# Altium schematic sheet Telemetry_schematic.SchDoc: oiaejrboidr
size A4; Revision: 1.1; SheetNumber: 1; SheetTotal: 1
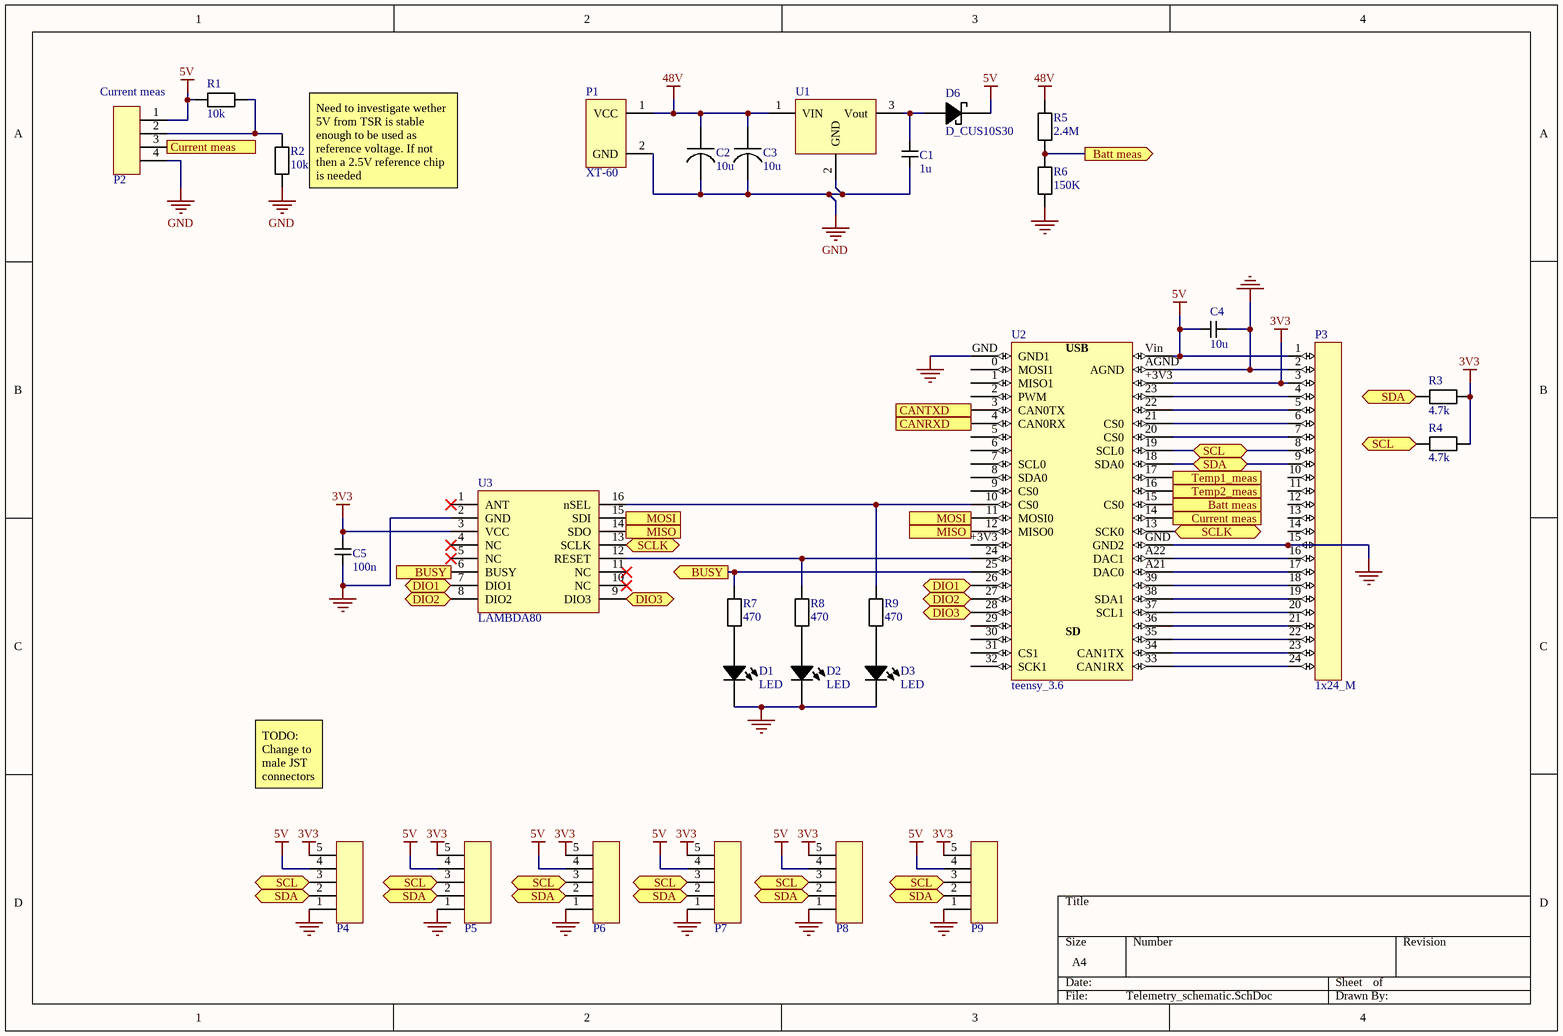
[diagram p0: Telemetry_schematic.SchDoc]

## Parts
C1  value 1u  [C_SMD_0805_pcb]  (hidden comment: SMD)
C2  value 10u  [C_EL_SMT_Ø6.3]  (hidden comment: C_EL_SMT_Ø6.3)
C3  value 10u  [C_EL_SMT_Ø6.3]  (hidden comment: C_EL_SMT_Ø6.3)
C4  value 10u  [C_SMD_0805_pcb]  (hidden comment: SMD)
C5  value 100n  [C_SMD_0805_pcb]  (hidden comment: SMD)
D1  LED  [D_LED_0805]
D2  LED  [D_LED_0805]
D3  LED  [D_LED_0805]
D6  D_CUS10S30  [D_SC-76]
P1  XT-60  [XT-60]
P2  JST_SE_4PIN  [JST_SE_4PIN]  (value not drawn)
P3  1x24_M  [PIN_HEADER_M_1x24]
P4  1x5_M  [PIN_HEADER_M_1x5]  (value not drawn)
P5  1x5_M  [PIN_HEADER_M_1x5]  (value not drawn)
P6  1x5_M  [PIN_HEADER_M_1x5]  (value not drawn)
P7  1x5_M  [PIN_HEADER_M_1x5]  (value not drawn)
P8  1x5_M  [PIN_HEADER_M_1x5]  (value not drawn)
P9  1x5_M  [PIN_HEADER_M_1x5]  (value not drawn)
R1  value 10k  [R_SMD_0805_pcb]  (hidden comment: SMD)
R2  value 10k  [R_SMD_0805_pcb]  (hidden comment: SMD)
R3  value 4.7k  [R_SMD_0805_pcb]  (hidden comment: SMD)
R4  value 4.7k  [R_SMD_0805_pcb]  (hidden comment: SMD)
R5  value 2.4M  [R_SMD_0805_pcb]  (hidden comment: SMD)
R6  value 150K  [R_SMD_0805_pcb]  (hidden comment: SMD)
R7  value 470  [R_SMD_0805_pcb]  (hidden comment: SMD)
R8  value 470  [R_SMD_0805_pcb]  (hidden comment: SMD)
R9  value 470  [R_SMD_0805_pcb]  (hidden comment: SMD)
U1  TSR_0.6-4850WI  [TSR_0.6-4850WI]  (value not drawn)
U2  teensy_3.6  [teensy_3.6]
U3  LAMBDA80  [LAMBDA62_SMT]

## Ports
Batt meas (in), Batt meas (out), BUSY (in), BUSY (out), CANRXD (out), CANTXD (in), Current meas (in), Current meas (out), DIO1 (bidir), DIO2 (bidir), DIO3 (bidir), MISO (in), MISO (out), MOSI (in), MOSI (out), SCL (bidir), SCLK (bidir), SDA (bidir), Temp1_meas (in), Temp2_meas (in)

## Nets
3V3: C5.1 P3.3 P4.5 P5.5 P6.5 P7.5 P8.5 P9.5 R3.1 R4.1 U2.+3V3 U3.3(VCC)
5V: C4.2 D6.2 P2.1 P3.1 P4.4 P5.4 P6.4 P7.4 P8.4 P9.4 R1.1 U2.Vin
48V: C2.2 C3.2 P1.1(VCC) R5.2 U1.1(VIN)
GND: C1.2 C2.1 C3.1 C4.1 C5.2 D1.2 D2.2 D3.2 P1.2(GND) P2.4 P3.2 P3.15 P4.1 P5.1 P6.1 P7.1 P8.1 P9.1 R2.1 R6.1 U1.2(GND) U2.AGND U2.GND(GND1) U3.2(GND)
Batt meas: R5.1 R6.2 U2.15(CS0) ; port Batt meas
BUSY: R7.2 U2.25 U3.6(BUSY) ; port BUSY
CANRXD: U2.4(CAN0RX) ; port CANRXD
CANTXD: U2.3(CAN0TX) ; port CANTXD
Current meas: P2.3 U2.14 ; port Current meas
DIO1: U2.26 U3.7(DIO1) ; port DIO1
DIO2: U2.27 U3.8(DIO2) ; port DIO2
DIO3: U2.28 U3.9(DIO3) ; port DIO3
MISO: U2.12(MISO0) U3.14(SDO) ; port MISO
MOSI: U2.11(MOSI0) U3.15(SDI) ; port MOSI
SCL: P3.8 P4.3 P5.3 P6.3 P7.3 P8.3 P9.3 R4.2 U2.19(SCL0) ; port SCL
SCLK: U2.13(SCK0) U3.13(SCLK) ; port SCLK
SDA: P3.9 P4.2 P5.2 P6.2 P7.2 P8.2 P9.2 R3.2 U2.18(SDA0) ; port SDA
Temp1_meas: U2.17 ; port Temp1_meas
Temp2_meas: U2.16 ; port Temp2_meas
NetC1_1: C1.1 D6.1 U1.3(Vout)
NetD1_1: D1.1 R7.1
NetD2_1: D2.1 R8.1
NetD3_1: D3.1 R9.1
NetP2_2: P2.2 R1.2 R2.2
NetP3_4: P3.4 U2.23
NetP3_5: P3.5 U2.22
NetP3_6: P3.6 U2.21(CS0)
NetP3_7: P3.7 U2.20(CS0)
NetP3_16: P3.16 U2.A22(DAC1)
NetP3_17: P3.17 U2.A21(DAC0)
NetP3_18: P3.18 U2.39
NetP3_19: P3.19 U2.38(SDA1)
NetP3_20: P3.20 U2.37(SCL1)
NetP3_21: P3.21 U2.36
NetP3_22: P3.22 U2.35
NetP3_23: P3.23 U2.34(CAN1TX)
NetP3_24: P3.24 U2.33(CAN1RX)
NetR8_2: R8.2 U2.24 U3.12(RESET)
NetR9_2: R9.2 U2.10(CS0) U3.16(nSEL)

Not connected (* = marked no-connect by the designer): P3 10 11 12 13 14; U2 0(MOSI1) 1(MISO1) 2(PWM) 5 6 7(SCL0) 8(SDA0) 9(CS0) 29 30 31(CS1) 32(SCK1); U3 1(ANT)* 4(NC)* 5(NC)* 10(NC)* 11(NC)*

## Notes on the sheet
- (near P2) Current meas
- (near R2) Need to investigate wether 5V from TSR is stable enough to be used as reference voltage. If not then a 2.5V reference chip is needed
- TODO: Change to male JST connectors
- (in symbol teensy_3.6) USB; SD

## Library data of the parts
C1 C4 C5 = C_SMD_0805: Supplier 1: *; Supplier Part Number 1: *
D1-D3 = D_LED_0805_SMD
D6 = D_CUS10S30: Schottky diode, 30V reverse voltage. 220mV forward drop @1A; Supplier Part Number 1: CUS10S30H3FCT-ND; Supplier Link 1: https://www.digikey.no/product-detail/en/toshiba-semiconductor-and-storage/CUS10S30H3F/CUS10S30H3FCT-ND/5114377
P3 = PIN_HEADER_M_1x24: Supplier Part Number 1: *; Supplier 1: *
P4-P9 = PIN_HEADER_M_1x5: Supplier Part Number 1: *; Supplier 1: *
R1-R9 = R_SMD_0805: Supplier 1: *; Supplier Part Number 1: *
U3 = LAMBDA_80_DIP
C2 C3 = C_EL_SMT_Ø6.3: Supplier 1: *; Supplier Part Number 1: *
P1 = XT-60: Supplier Part Number 1: *; Supplier 1: *
P2 = JST_SE_4PIN: Supplier Link 1: https://www.digikey.com/product-detail/en/jst-sales-america-inc/S4B-XH-A-LF-SN/455-2243-ND/1651041; Supplier Part Number 1: 455-2243-ND
U2 = teensy_3.6: Supplier 1: *; Supplier Part Number 1: *